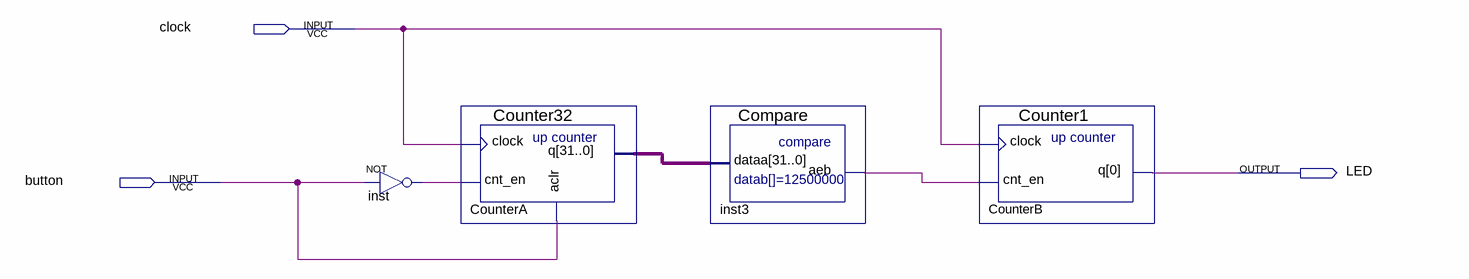
[diagram p0: schematic sheet]
// Quartus schematic debounce_t.bdf as structural Verilog: 4 symbols, 3 pins
module debounce_t (
  input  clock,
  input  button,
  output LED
);

  wire inst3_aeb, inst_out;
  wire [31:0] CounterA_q;

  not inst (inst_out, button);
  Counter32 CounterA (.clock(clock), .cnt_en(inst_out), .aclr(button), .q(CounterA_q));
  Compare inst3 (.dataa(CounterA_q), .aeb(inst3_aeb));
  Counter1 CounterB (.clock(clock), .cnt_en(inst3_aeb), .q(LED));
endmodule
